# EAGLE design flow3r-pot (EAGLE 9.6.2)
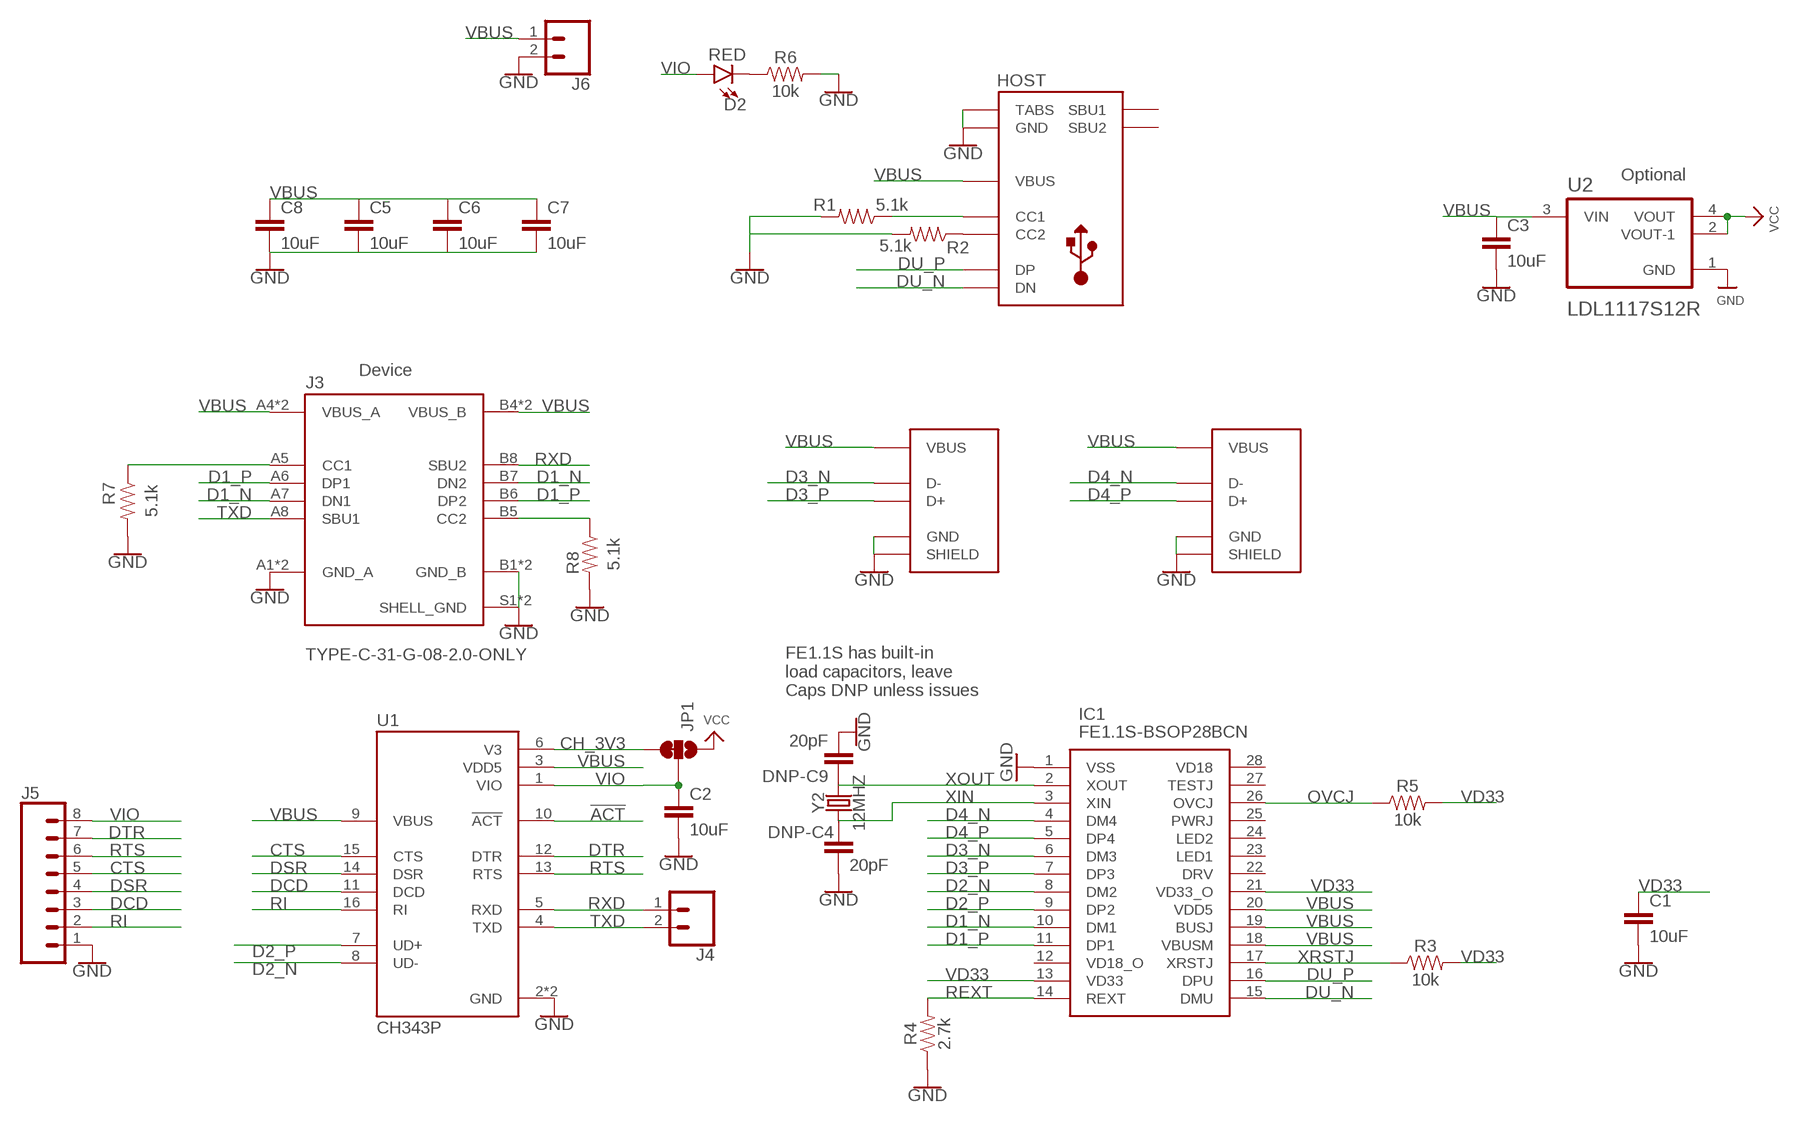
[diagram p0: schematic, sheet 1]

## Parts
C1  10uF  1.0UF-0603-16V-10%  [0603]
C2  10uF  1.0UF-0603-16V-10%  [0603]
C3  10uF  1.0UF-0603-16V-10%  [0603]
C5  10uF  1.0UF-0603-16V-10%  [0603]
C6  10uF  1.0UF-0603-16V-10%  [0603]
C7  10uF  1.0UF-0603-16V-10%  [0603]
C8  10uF  1.0UF-0603-16V-10%  [0603]
D2  RED  LED-RED0603  [LED-0603]
DNP-C4  20pF  20PF-0402T-50V-5%  [0402-TIGHT]
DNP-C9  20pF  20PF-0402T-50V-5%  [0402-TIGHT]
IC1  FE1.1S-BSOP28BCN  [SOP64P600X175-28N]
J1  JE-USB-A-C42595  [JE-USB-A-C42595]
J2  JE-USB-A-C42595  [JE-USB-A-C42595]
J3  TYPE-C-31-G-08-2.0-ONLY  [TYPE-C-31-G-08-2.0-ONLY]
J4  CONN_02  [1X02]
J5  CONN_08LOCK_LONGPADS  [1X08_LOCK_LONGPADS]
J6  CONN_02  [1X02]
JP1  JUMPER-SMT_3_1-NC_TRACE_NO-SILK  [SMT-JUMPER_3_1-NC_TRACE_NO-SILK]
R1  5.1k  5.1KOHM5.1KOHM-0603-1/10W-1%  [0603]
R2  5.1k  5.1KOHM5.1KOHM-0603-1/10W-1%  [0603]
R3  10k  10KOHM-0603-1/10W-1%  [0603]
R4  2.7k  2.7KOHM-0603-1/10W-1%  [0603]
R5  10k  10KOHM-0603-1/10W-1%  [0603]
R6  10k  10KOHM-0603-1/10W-1%  [0603]
R7  5.1k  5.1KOHM5.1KOHM-0603-1/10W-1%  [0603]
R8  5.1k  5.1KOHM5.1KOHM-0603-1/10W-1%  [0603]
U1  CH343P  [QFN50P300X300X80-17N]
U2  LDL1117S12R  [SOT230P700X180-4N]
USB-C-HOST  C709357  TYPE-C-31-M-12  [USB-TYPE-C_16PIN-MALE-TYPE-C-31-M-12]
Y2  12MHZ  CRYSTAL-12MHZ  [CRYSTAL-SMD-2X2.5MM]

## Nets
!ACT: U1.10(!ACT)
CH_3V3: JP1.3 U1.6(V3)
CTS: J5.5 U1.15(CTS)
D1_N: IC1.10(DM1) J3.A7(DN1) J3.B7(DN2)
D1_P: IC1.11(DP1) J3.A6(DP1) J3.B6(DP2)
D2_N: IC1.8(DM2) U1.8(UD-)
D2_P: IC1.9(DP2) U1.7(UD+)
D3_N: IC1.6(DM3) J1.D-
D3_P: IC1.7(DP3) J1.D+
D4_N: IC1.4(DM4) J2.D-
D4_P: IC1.5(DP4) J2.D+
DCD: J5.3 U1.11(DCD)
DSR: J5.4 U1.14(DSR)
DTR: J5.7 U1.12(DTR)
DU_N: IC1.15(DMU) USB-C-HOST.A7(DN) USB-C-HOST.B7(DN)
DU_P: IC1.16(DPU) USB-C-HOST.A6(DP) USB-C-HOST.B6(DP)
GND: C1.2 C2.2 C3.2 C5.2 C6.2 C7.2 C8.2 DNP-C4.2 DNP-C9.2 IC1.1(VSS) J1.GND J1.SHIELD-1(SHIELD) J1.SHIELD-2(SHIELD) J2.GND J2.SHIELD-1(SHIELD) J2.SHIELD-2(SHIELD) J3.A1(GND_A) J3.A12(GND_A) J3.B1(GND_B) J3.B12(GND_B) J3.S1(SHELL_GND) J3.S2(SHELL_GND) J5.1 J6.2 R1.2 R2.2 R4.1 R6.2 R7.2 R8.2 U1.2(GND) U1.17(GND) U2.1(GND) USB-C-HOST.0(TABS) USB-C-HOST.0-1(TABS) USB-C-HOST.0-2(TABS) USB-C-HOST.0-3(TABS) USB-C-HOST.A1(GND) USB-C-HOST.A12(GND) USB-C-HOST.B1(GND) USB-C-HOST.B12(GND)
N$1: R2.1 USB-C-HOST.B5(CC2)
N$2: R1.1 USB-C-HOST.A5(CC1)
N$3: D2.C R6.1
N$4: J3.B5(CC2) R8.1
N$5: J3.A5(CC1) R7.1
OVCJ: IC1.26(OVCJ) R5.1
REXT: IC1.14(REXT) R4.2
RI: J5.2 U1.16(RI)
RTS: J5.6 U1.13(RTS)
RXD: J3.B8(SBU2) J4.1 U1.5(RXD)
TXD: J3.A8(SBU1) J4.2 U1.4(TXD)
VBUS: C3.1 C5.1 C6.1 C7.1 C8.1 IC1.18(VBUSM) IC1.19(BUSJ) IC1.20(VDD5) J1.VBUS J2.VBUS J3.A4(VBUS_A) J3.A9(VBUS_A) J3.B4(VBUS_B) J3.B9(VBUS_B) J6.1 U1.3(VDD5) U1.9(VBUS) U2.3(VIN) USB-C-HOST.A4(VBUS) USB-C-HOST.A9(VBUS) USB-C-HOST.B4(VBUS) USB-C-HOST.B9(VBUS)
VCC [VCC]: JP1.1 U2.2(VOUT-1) U2.4(VOUT)
VD33: C1.1 IC1.13(VD33) IC1.21(VD33_O) R3.2 R5.2
VIO: C2.1 D2.A J5.8 JP1.2 U1.1(VIO)
XIN: DNP-C4.1 IC1.3(XIN) Y2.P1
XOUT: DNP-C9.1 IC1.2(XOUT) Y2.P3
XRSTJ: IC1.17(XRSTJ) R3.1
Unconnected: IC1.12(VD18_O) IC1.22(DRV) IC1.23(LED1) IC1.24(LED2) IC1.25(PWRJ) IC1.27(TESTJ) IC1.28(VD18) USB-C-HOST.A8(SBU1) USB-C-HOST.B8(SBU2)

## Notes on the sheet
- HOST
- Optional
- Device
- FE1.1S has built-in
  load capacitors, leave
  Caps DNP unless issues

## Library data of the parts
C1-C3 C5-C8 = SparkFun-Capacitors:1.0UF: 1µF ceramic capacitors A capacitor is a passive two-terminal electrical component used to store electrical energy temporarily in an electric field.; PROD_ID: CAP-00868; VALUE: 1.0uF
D2 = SparkFun-LED:LED-RED: Red SMD LED Used in manufacturing of most products at SparkFun Packages: 0603 - SMD 0603 package [Product Link] <http://docs.avagotech.com/docs/AV02-0551EN> 0603 SMART - SMD 0603 SMART package ( more efficient and expensive)[Product Link] <http://www.osram-os.com/Graphics/XPic2/00077099_0.pdf> 1206 - SMD1206 package [Product Link] <https://www.sparkfun.com/datasheets/DevTools/LilyPad/Q150OVS4.pdff> SparkFun Products: Pro Mini 328 -5V <https://www.sparkfun.com/products/821> RedBoard <https://www.sparkfun.com/products/12757> IOIO-OTG <https://www.sparkfun.com/products/13613>; PROD_ID: DIO-00819
DNP-C4 DNP-C9 = SparkFun-Capacitors:20PF: 20pF ceramic capacitors A capacitor is a passive two-terminal electrical component used to store electrical energy temporarily in an electric field.; PROD_ID: CAP-14843
IC1 = SamacSys_Parts:FE1.1S-BSOP28BCN: FE1.1S USB 2.0 High Speed 4-Port Hub Controller Source: Datasheet <https://datasheet.lcsc.com/lcsc/1811021220_Terminus-Tech-FE1-1S-BSOP28BCN_C9359.pdf>; DESCRIPTION: FE1.1S USB 2.0 High Speed 4-Port Hub Controller; HEIGHT: 1.75mm; MANUFACTURER_NAME: Terminus Technology; MANUFACTURER_PART_NUMBER: FE1.1S-BSOP28BCN
J1 J2 = Custom-Parts:JE-USB-A-C42595
J3 = TYPE-C-31-G-08:TYPE-C-31-G-08-2.0-ONLY; DESCRIPTION: USB-C (USB TYPE-C) USB 3.2 Gen 2 (USB 3.1 Gen 2, Superspeed + (USB 3.1)) Plug Connector 24 Position Board Edge, Cutout; Surface Mount; Through Hole, Right Angle; MF: HRO; MP: TYPE-C-31-G-08; PACKAGE: None; PRICE: None
J4 J6 = SparkFun-Connectors:CONN_02: Multi connection point. Often used as Generic Header-pin footprint for 0.1 inch spaced/style header connections On any of the 0.1 inch spaced packages, you can populate with these: Break Away Headers - Straight <https://www.sparkfun.com/products/116> (PRT-00116) Break Away Male Headers - Right Angle <https://www.sparkfun.com/products/553> (PRT-00553) Female Headers <https://www.sparkfun.com/products/115> (PRT-00115) Break Away Headers - Machine Pin <https://www.sparkfun.com/products/117> (PRT-00117) Break Away Female Headers - Swiss Machine Pin <https://www.sparkfun.com/products/743> (PRT-00743) For SCREWTERMINALS and SPRING TERMINALS visit here: Screw Terimnals on SparkFun.com <https://www.sparkfun.com/search/results?term=Screw+Terminals> (5mm/3.5mm/2.54mm spacing) This device is also useful as a general connection point to wire up your design to another part of your project. Our various solder wires solder well into these plated through hole pads. Hook-Up Wire - Assortment (Stranded, 22 AWG) <https://www.sparkfun.com/products/11375> (PRT-11375) Hook-Up Wire - Assortment (Solid Core, 22 AWG) <https://www.sparkfun.com/products/11367> (PRT-11367) View the entire wire category on our website here <https://www.sparkfun.com/categories/141> Special notes: Molex polarized connector foot print use with: PRT-08233 with associated crimp pins and housings. 2.54_SCREWTERM for use with PRT-10571. 3.5mm Screw Terminal footprints for PRT-08084 5mm Screw Terminal footprints for use with PRT-08432
J5 = SparkFun-Connectors:CONN_08: Multi connection point. Often used as Generic Header-pin footprint for 0.1 inch spaced/style header connections On any of the 0.1 inch spaced packages, you can populate with these: Break Away Headers - Straight <https://www.sparkfun.com/products/116> (PRT-00116) Break Away Male Headers - Right Angle <https://www.sparkfun.com/products/553> (PRT-00553) Female Headers <https://www.sparkfun.com/products/115> (PRT-00115) Break Away Headers - Machine Pin <https://www.sparkfun.com/products/117> (PRT-00117) Break Away Female Headers - Swiss Machine Pin <https://www.sparkfun.com/products/743> (PRT-00743) Arduino Stackable Header - 8 Pin <https://www.sparkfun.com/products/9279> (PRT-09279) For SCREWTERMINALS and SPRING TERMINALS visit here: Screw Terimnals on SparkFun.com <https://www.sparkfun.com/search/results?term=Screw+Terminals> (5mm/3.5mm/2.54mm spacing) This device is also useful as a general connection point to wire up your design to another part of your project. Our various solder wires solder well into these plated through hole pads. Hook-Up Wire - Assortment (Stranded, 22 AWG) <https://www.sparkfun.com/products/11375> (PRT-11375) Hook-Up Wire - Assortment (Solid Core, 22 AWG) <https://www.sparkfun.com/products/11367> (PRT-11367) View the entire wire category on our website here <https://www.sparkfun.com/categories/141> Special notes: Molex polarized connector foot print use with SKU : PRT-08231 with associated crimp pins and housings. 1MM SMD Version SKU: PRT-10208 NOTES ON THE VARIANTS LOCK and LOCK_LONGPADS... This footprint was designed to help hold the alignment of a through-hole component (i.e. 6-pin header) while soldering it into place. You may notice that each hole has been shifted either up or down by 0.005 of an inch from it's more standard position (which is a perfectly straight line). This slight alteration caused the pins (the squares in the middle) to touch the edges of the holes. Because they are alternating, it causes a "brace" to hold the component in place. 0.005 has proven to be the perfect amount of "off-center" position when using our standard breakaway headers. Although looks a little odd when you look at the bare footprint, once you have a header in there, the alteration is very hard to notice. Also,if you push a header all the way into place, it is covered up entirely on the bottom side.
JP1 = SparkFun-Jumpers:JUMPER-SMT_3_1-NC_TRACE: Normally closed trace jumper (1 of 2 connections) This jumper has a trace between two pads so it's normally closed (NC). The other connection is normally open (NO). Use a razor knife to open the connection. For best results follow the IPC guidelines for cutting traces: Cutout at least 0.063 mm (0.005 in). Remove all loose material to clean up the cut area. Seal the cut with an approved epoxy. Reapply solder to reclose the connection, or to close the NO connection.
R1 R2 R7 R8 = SparkFun-Resistors:5.1KOHM; PROD_ID: RES-12083
R3 R5 R6 = SparkFun-Resistors:10KOHM: 10kΩ resistor A resistor is a passive two-terminal electrical component that implements electrical resistance as a circuit element. Resistors act to reduce current flow, and, at the same time, act to lower voltage levels within circuits. - Wikipedia; PROD_ID: RES-00824
R4 = SparkFun-Resistors:2.7KOHM: 2.7kΩ resistor A resistor is a passive two-terminal electrical component that implements electrical resistance as a circuit element. Resistors act to reduce current flow, and, at the same time, act to lower voltage levels within circuits. - Wikipedia; PROD_ID: RES-16714
U1 = CH343P:CH343P: Check availability <https://pricing.snapeda.com/parts/CH343P/WCH/view-part?ref=eda>; AVAILABILITY: Not in stock; DESCRIPTION: USB to High-Speed Serial Chip CH343; MF: WCH; MP: CH343P; PACKAGE: Package; PRICE: None
U2 = LDL1117S12R:LDL1117S12R: None; AVAILABILITY: Good; DESCRIPTION: 1.2 A High PSRR low dropout linear voltage regulator; MF: STMicroelectronics; MP: LDL1117S12R; PACKAGE: SOT-223 STMicroelectronics; PRICE: 0.22 USD
USB-C-HOST = Custom-Parts:TYPE-C-31-M-12
Y2 = SparkFun-Clocks:CRYSTAL-12MHZ: 12.0MHz Crystal Frequency: 12.0MHz Frequency Tolerance: ±20ppm Load Capacitance: 18pF SparkFun Products: SparkFun Logomatic <https://www.sparkfun.com/products/12772> Pocket AVR Programmer <https://www.sparkfun.com/products/9825>; PROD_ID: XTAL-15540

## Board
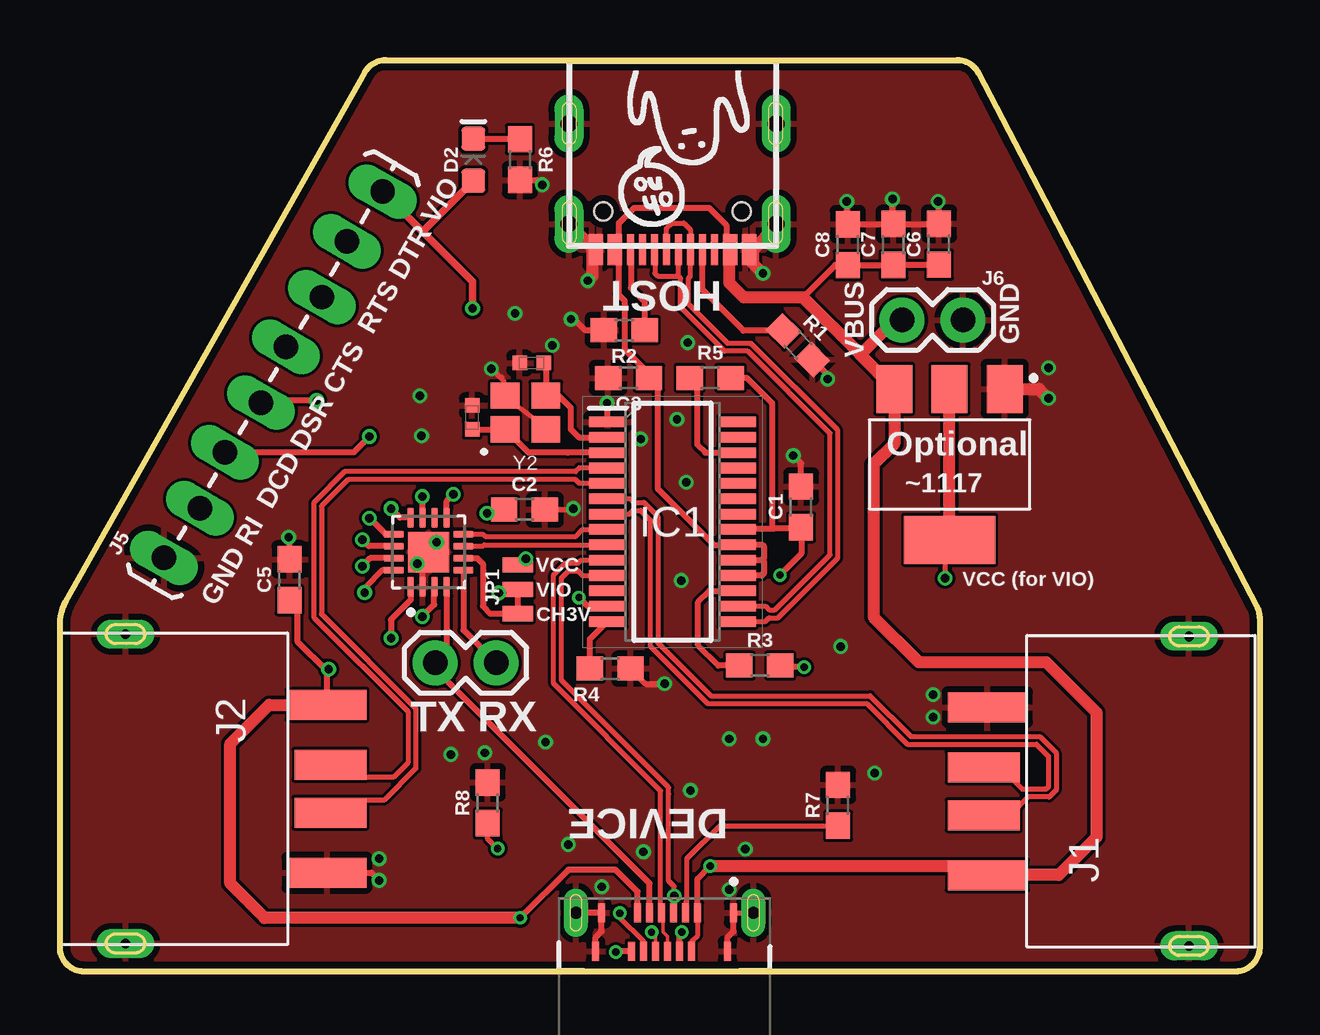
[diagram p1: board, top side]
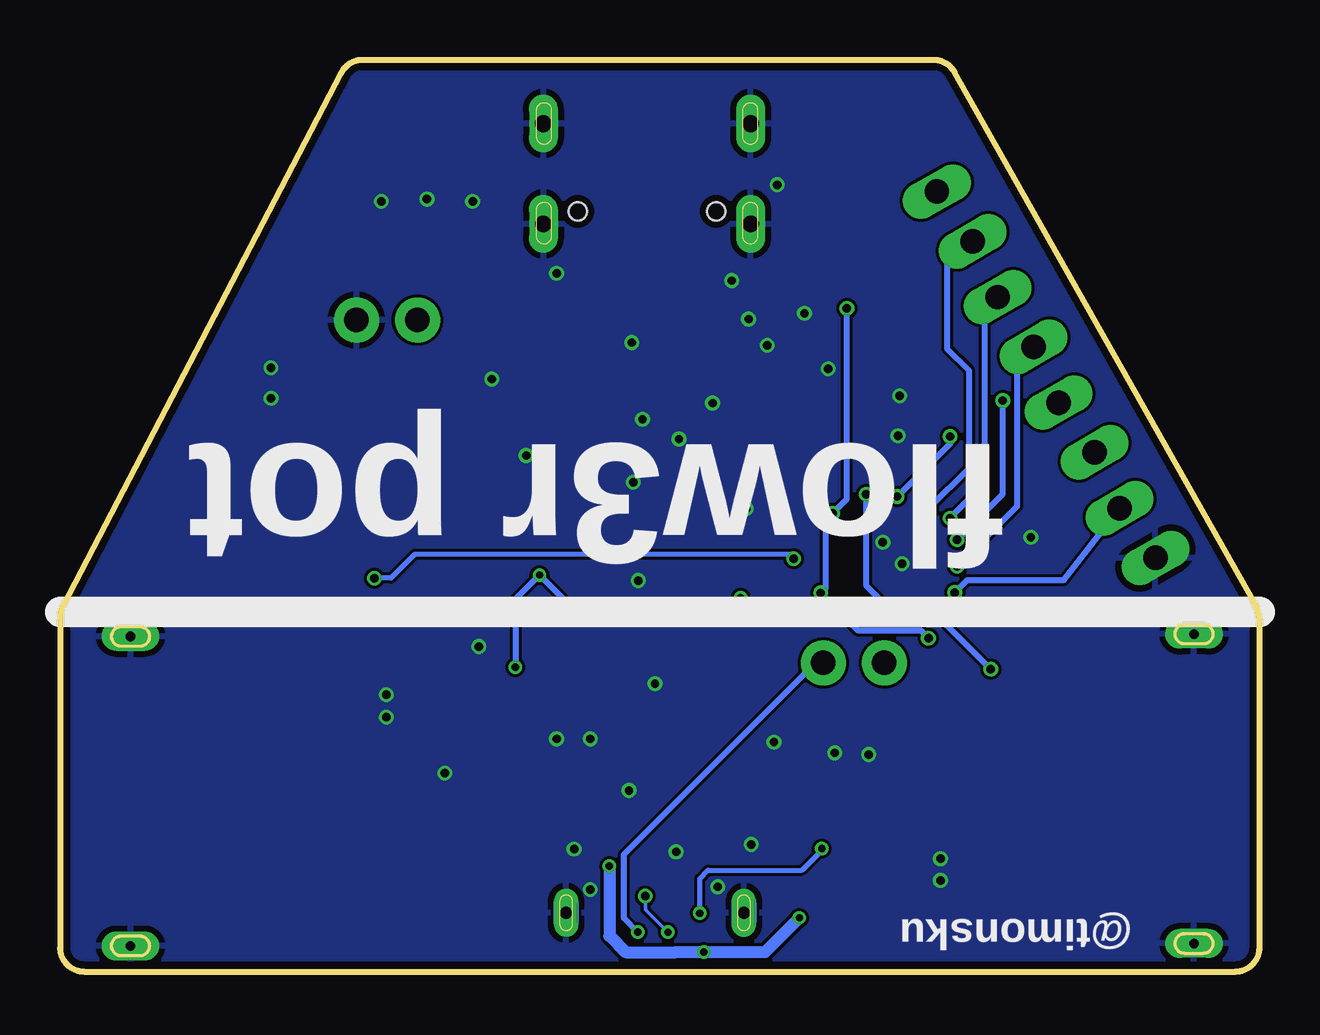
[diagram p2: board, bottom side, seen from below]

Size 50 x 38 mm. Coordinates in mm from the lower left corner, seen from the top.
Outline: 0.25,15.44 12.71,37.49 arc-61 13.58,38 37.39,38 arc-62 38.28,37.46 49.89,15.22 arc-28 50,14.76 50,1 arc-90 49,0 1,0 arc-90 0,1 0,14.5 arc-29 0.25,15.44
Copper layers (1*16): Top 0.035mm / dielectric 0.8mm / Bottom 0.035mm
Design rules "jlc-2layer *": minimum track width 5mil, minimum drill 0.3mm, track to track 5mil, track to pad 5mil, pad to pad 5mil, via to via 5mil, smd to smd 0mil, copper to edge 0.3mm, drill to drill 0.5mm, minimum pad ring 10mil, minimum via ring 0.13mm, stop-mask expansion 2mil, vias tented up to drill 100mil, thermal gap 10mil

### Footprints (pad centres in the part's own frame; a part is rotated, then mirrored left to right if it is on the bottom)
0603 = smd 1.1 x 1: 1 -0.85,0; 2 0.85,0
LED-0603 = smd 1 x 1: A -0.877,0; C 0.877,0
0402-TIGHT = smd 0.6 x 0.6: 1 -0.5,0; 2 0.5,0
SOP64P600X175-28N = smd 1.525 x 0.44: 1 -2.712,4.16; 2 -2.712,3.52; 3 -2.712,2.88; 4 -2.712,2.24; 5 -2.712,1.6; 6 -2.712,0.96; 7 -2.712,0.32; 8 -2.712,-0.32; 9 -2.712,-0.96; 10 -2.712,-1.6; 11 -2.712,-2.24; 12 -2.712,-2.88; 13 -2.712,-3.52; 14 -2.712,-4.16; 15 2.712,-4.16; 16 2.712,-3.52; 17 2.712,-2.88; 18 2.712,-2.24; 19 2.712,-1.6; 20 2.712,-0.96; 21 2.712,-0.32; 22 2.712,0.32; 23 2.712,0.96; 24 2.712,1.6; 25 2.712,2.24; 26 2.712,2.88; 27 2.712,3.52; 28 2.712,4.16
JE-USB-A-C42595 = smd 1.25 x 3: D+ 1,4.8; D- -1,4.8 | smd 1.25 x 3.3: GND 3.5,4.65; VBUS -3.5,4.65 | drill 0.4 pad 1.2 long: SHIELD-1 -6.45,-3.75; SHIELD-2 6.45,-3.75
TYPE-C-31-G-08-2.0-ONLY = smd 0.3 x 0.8: A1 2.875,0.85; A4 1.375,0.85; A5 0.875,0.85; A6 0.375,0.85; A7 -0.125,0.85; A8 -0.625,0.85; A9 -1.125,0.85; A12 -2.625,0.85; B1 -2.875,-0.75; B4 -1.375,-0.75; B5 -0.875,-0.75; B6 -0.375,-0.75; B7 0.125,-0.75; B8 0.625,-0.75; B9 1.125,-0.75; B12 2.625,-0.75 | drill 0.5 pad 0.8 long: S1 -3.7,0.85; S2 3.7,0.85
1X02 = drill 1.016 pad 1.88: 1 0,0; 2 2.54,0
1X08_LOCK_LONGPADS = drill 1.016 long: 1 0,0.127; 2 2.54,-0.127; 3 5.08,0.127; 4 7.62,-0.127; 5 10.16,0.127; 6 12.7,-0.127; 7 15.24,0.127; 8 17.78,-0.127
SMT-JUMPER_3_1-NC_TRACE_NO-SILK = smd 0.635 x 1.27: 1 -1.016,0; 2 0,0; 3 1.016,0
QFN50P300X300X80-17N = smd 0.84 x 0.28: 1 -1.445,0.75; 2 -1.445,0.25; 3 -1.445,-0.25; 4 -1.445,-0.75; 9 1.445,-0.75; 10 1.445,-0.25; 11 1.445,0.25; 12 1.445,0.75 | smd 0.28 x 0.84: 5 -0.75,-1.445; 6 -0.25,-1.445; 7 0.25,-1.445; 8 0.75,-1.445; 13 0.75,1.445; 14 0.25,1.445; 15 -0.25,1.445; 16 -0.75,1.445 | smd 1.7 x 1.7: 17 0,0
SOT230P700X180-4N = smd 1.5 x 2: 1 -2.3,-3.15; 2 0,-3.15; 3 2.3,-3.15 | smd 3.8 x 2: 4 0,3.15
USB-TYPE-C_16PIN-MALE-TYPE-C-31-M-12 = drill 0.7 pad 1.2 long: 0 -4.32,1.556; 0-1 4.32,1.556; 0-2 4.32,-2.624; 0-3 -4.32,-2.624 | smd 0.3 x 1.3: A1 -3.35,2.623; A4 -2.55,2.623; A5 -1.25,2.623; A6 -0.25,2.623; A7 0.25,2.623; A8 1.25,2.624; A9 2.55,2.623; A12 3.35,2.623; B1 3.05,2.623; B4 2.25,2.623; B5 1.75,2.623; B6 0.75,2.623; B7 -0.75,2.623; B8 -1.75,2.624; B9 -2.25,2.623; B12 -3.05,2.623 | hole 0.75: 2.89,1.026; -2.89,1.026
CRYSTAL-SMD-2X2.5MM = smd 1.2 x 1.1: P1 0.846,0.69; P2 -0.854,0.69; P3 -0.854,-0.71; P4 0.846,-0.71

### Placement (x,y rotation side)
C1  30.89,19.37 90 top
C2  19.36,19.26 0 top
C3  23.7,24.75 180 top
C5  9.57,16.33 90 top
C6  36.64,30.32 90 top
C7  34.74,30.31 90 top
C8  32.84,30.3 90 top
D2  17.23,33.84 90 top
DNP-C4  17.18,23.1 90 top
DNP-C9  19.66,25.37 180 top
IC1  25.53,18.75 0 top
J1  43.31,7.52 90 top
J2  6.48,7.62 270 top
J3  25.2,1.6 0 top
J4  18.18,12.87 180 top
J5  4.45,17.18 60 top
J6  35.1,27.16 0 top
JP1  19.08,15.93 270 top
R1  30.76,26.11 315 top
R2  23.52,26.74 180 top
R3  29.17,12.76 0 top
R4  22.93,12.63 180 top
R5  27.1,24.74 0 top
R6  19.17,33.85 270 top
R7  32.43,6.93 90 top
R8  17.83,7.03 90 top
U1  15.37,17.48 90 top
U2  37.08,21.14 180 top
U$2  [OHNO-6.5]  28.75,37.54 180 top
USB-C-HOST  25.53,32.72 180 top
Y2  19.4,23.3 180 top

### Tracks (layer width: path | path; a pad name or v marks a point on that pad's centre or on a via)
CH_3V3
  Top 0.254: U1.6 17.39,17.23 17.63,16.99 17.63,15.22 17.94,14.91 JP1.3
CTS  (via drill 0.35)
  Top 0.254: U1.15 12.93,17.23 v12.6,16.9
  Bottom 0.2: 10.1,25 9.42,25.68 J5.5
  Bottom 0.254: v12.6,16.9 10.1,19.4 10.1,25
D1_N
  Top 0.152: J3.A7 25.14,2.38 25.14,1.66 25.32,1.48 J3.B7
  Top 0.2: IC1.10 21.72,17.15 21.6,17.03 21.07,17.03 20.57,16.54 20.57,12.01 25.04,7.54 25.04,2.49 J3.A7
D1_P  (via drill 0.3, 0.35)
  Top 0.152: J3.B6 24.82,1.48 v24.66,1.64
  Top 0.2: IC1.11 21.79,16.51 21.6,16.7 21.2,16.7 20.9,16.4 20.9,12.14 25.37,7.67 25.37,7.39 25.37,3.79 25.6,3.55 v25.6,3.14 v25.59,3.13 25.59,2.47 J3.A6
  Bottom 0.152: v24.66,1.64 25.6,2.58 v25.6,3.14
D2_N
  Top 0.2: U1.8 17.64,18.23 17.72,18.14 21.5,18.14 21.79,18.43 IC1.8
D2_P
  Top 0.2: U1.7 17.64,17.73 17.7,17.79 IC1.9
D3_N
  Top 0.2: IC1.6 23.75,19.71 23.91,19.55 24.34,19.55 24.93,18.96 24.93,13.7 27.13,11.5 33.76,11.5 35.46,9.8 40.84,9.8 41.53,9.11 41.53,7.57 41.23,7.27 40.34,7.27 39.59,6.52 J1.D-
D3_P
  Top 0.2: IC1.7 23.73,19.07 23.89,19.23 24.2,19.23 24.6,18.83 24.6,13.56 26.99,11.17 33.63,11.17 35.33,9.47 40.7,9.47 41.2,8.97 41.2,7.7 41.1,7.6 40.1,7.6 39.19,8.52 J1.D+
D4_N
  Top 0.2: IC1.4 21.66,20.99 21.5,20.83 11.87,20.83 10.57,19.54 10.57,14.77 14.5,10.84 14.5,8.7 13.9,8.1 11.8,8.1 J2.D-
D4_P
  Top 0.2: IC1.5 21.66,20.35 21.5,20.51 12.01,20.51 11.35,19.85 10.9,19.4 10.9,14.9 14.83,10.97 14.83,8.46 13.5,7.14 11.8,7.14 J2.D+
DCD  (via drill 0.35)
  Top 0.254: U1.11 15.12,19.78 v15.1,19.8 | v12.9,22.3 12.24,21.64 J5.3
  Bottom 0.254: v15.1,19.8 12.9,22 v12.9,22.3
DSR  (via drill 0.35)
  Top 0.254: U1.14 12.87,17.73 v12.6,18 | J5.4 8.45,23.8 v10.7,23.8
  Bottom 0.254: v12.6,18 10.7,19.9 v10.7,23.8
DTR  (via drill 0.35)
  Top 0.254: U1.12 14.18,18.93 v13.8,19.3
  Bottom 0.254: v13.8,19.3 12.1,21 12.1,25.04 13.03,25.97 13.03,29.71 12.3,30.44 J5.7
DU_N
  Top 0.2: IC1.15 29.4,14.59 29.56,14.75 29.93,14.75 32.43,17.24 32.43,22.57 28.8,26.19 27.84,26.19 26.2,27.83 26.2,28.9 26.28,28.98 USB-C-HOST.B7 26.28,30.92 26,31.2 25.5,31.2 25.28,30.98 USB-C-HOST.A7
DU_P
  Top 0.2: IC1.16 29.4,15.23 29.56,15.07 29.8,15.07 32.1,17.37 32.1,22.43 28.67,25.86 27.7,25.86 25.87,27.69 25.87,28.9 25.78,28.99 | 25.78,28.99 USB-C-HOST.A6 | USB-C-HOST.B6 24.8,30.08 24.8,29.1 24.91,28.99 25.78,28.99
GND  (via drill 0.35)
  Top 0.2: C2.2 21.4,19.26 v21.4,19.3 | J3.A1 J3.S2 | 18.41,24.79 18.32,24.79 v17.98,25.13 18.49,24.62 18.49,24.01 20.36,22.59
  Top 0.254: C1.2 30.89,21.19 v30.57,21.51 | v22.8,23.7 22.82,23.68 IC1.1 22.62,22.91 | R4.1 24.41,12 v25.2,12 | C6.2 | C7.2 C6.2 | C7.2 C8.2 32.8,31.19 v32.8,32.1 | C7.2 34.7,31.2 v34.7,32.2 | C6.2 36.64,32.06 v36.6,32.1 | C5.2 9.57,18.06 v9.53,18.1 | v14.9,17.01 U1.17 15.7,17.81 v15.7,17.9 | v14.9,17.01 v14.9,17 | U1.2 15.12,16.79 v14.9,17.01 | R2.2 21.89,26.74 21.43,27.2 v21.3,27.2 | R6.2 19.9,33 v20.1,32.8 | R1.2 32,24.87 v32,24.7 | J2.GND 12.98,4.12 v13.3,3.8 | J3.B1 22.32,1.43 22.57,1.68 J3.A12 J3.S1 | J3.B12 27.82,1.43 28.07,1.68 J3.A1
  Top 0.508: U2.1 40.81,24.29 v41.2,23.9 | USB-C-HOST.0 29.85,31.07 USB-C-HOST.A1 28.88,29.52 v29.3,29.1 | USB-C-HOST.0-1 22.18,30.19 USB-C-HOST.A12 22.18,28.98 v22,28.8
  other vias: 20.52,26.1 26.16,26.22 13.3,4.7 36.4,10.6 36.4,11.54 26.1,20.4 25.9,16.3 25.72,23.02 18.97,27.44 15,24 15.07,22.33 20.24,9.56 27.9,9.7 29.3,9.7 24.2,22.2 22.58,3.53 27.9,3.42 16.29,9.05 28.57,5.11 24.32,4.99 26.28,7.55 21.19,5.3 32.54,13.55 41.21,25.16 33.96,8.26 17.71,9.12
  pour Top: -4,40.5 56.5,40.5 56.5,-3 -4,-3
  pour Bottom: -6.5,42.5 59.5,42.5 59.5,-6 -6.5,-6
N$1
  Top 0.254: USB-C-HOST.B5 23.8,30.08 23.8,28.5 24.37,27.93 R2.1
N$2
  Top 0.254: R1.1 28.49,26.71 26.78,28.42 USB-C-HOST.A5
N$3
  Top 0.254: D2.C 19.15,34.72 R6.1
N$4  (via drill 0.3)
  Top 0.203: J3.B5 24.32,1.25 23.33,2.24 v23.33,2.43 | v18.25,5.12 17.83,5.54 R8.1
  Bottom 0.203: v23.33,2.43 23.33,3.87 22.98,4.22 19.08,4.22 18.25,5.05 v18.25,5.12
N$5
  Top 0.203: J3.A5 26.07,2.86 26.13,2.92 26.13,4.71 27.5,6.08 R7.1
OVCJ
  Top 0.254: R5.1 26.56,24.43 26.56,21.97 26.9,21.63 IC1.26
REXT
  Top 0.254: IC1.14 22.08,13.85 R4.2
RI  (via drill 0.35)
  Top 0.254: U1.16 13.46,16.73 12.7,15.97 v12.7,15.8
  Bottom 0.254: v12.7,15.8 12.18,16.32 8.16,16.32 J5.2
RTS  (via drill 0.35)
  Top 0.2: U1.13 13.57,18.23
  Top 0.254: 13.57,18.23 v12.9,18.9
  Bottom 0.254: v12.9,18.9 11.44,20.36 11.44,27.59 J5.6
RXD  (via drill 0.3)
  Top 0.254: U1.5 16.82,14.23 J4.1 | J3.B8 25.82,1.55 v25.92,1.64
  Bottom 0.254: v25.92,1.64 26.5,2.22 26.5,4.88 18.51,12.87 J4.1
TXD
  Top 0.254: U1.4 16.12,13.35 J4.2 15.64,12.61 24.57,3.67 J3.A8
VBUS  (via drill 0.3, 0.35)
  Top 0.2: 27.9,29.5 27.9,29.98 USB-C-HOST.B9 USB-C-HOST.A4 | USB-C-HOST.A9 USB-C-HOST.B4 | J3.B9 26.32,1.25 26.59,1.52 26.59,2.44 J3.A4
  Top 0.254: USB-C-HOST.B4 23.28,28.22 23.54,27.96 23.54,25.94 24.45,25.03 24.45,24.85 C3.1 24.91,24.39 24.91,20.14 27.26,17.79 IC1.20 29.28,17.79 29.36,17.71 29.36,17.25 29.27,17.16 | J2.VBUS 11.13,12.53 | 11.13,12.53 v11.2,12.6 | v15.1,14.8 15.6,15.3 15.6,16.02 U1.3 | U1.9 16.12,19.62 v16.4,19.9 | USB-C-HOST.A9 23.3,30.42 23.3,31.2 23.94,31.84 27.06,31.84 27.78,31.12 USB-C-HOST.B9 | 30.97,28.1 32.32,29.45 C8.1 C7.1 C6.1 | J3.A4 26.57,3.88 v27.1,4.4 | J3.A9 24.07,3.33 23.15,4.25 21.19,4.25 v19.18,2.24 | C5.1 9.89,15.16 9.89,13.77 11.13,12.53 | IC1.19 28.25,17.16 29.27,17.16 | 29.27,17.16 29.35,17.08 29.35,16.61 29.25,16.51 IC1.18 | J3.B4 23.21,0.85 v23.17,0.81
  Top 0.508: 33.36,25.71 U2.3 34.78,22 33.91,21.13 33.91,14.79 35.8,12.9 41.1,12.9 43.2,10.8 43.2,5.6 41.63,4.03 J1.VBUS 37.67,4.02 37.3,4.39 v27.11,4.39 v27.1,4.4 | 33.36,25.71 30.97,28.1 28.5,28.1 27.9,28.7 27.9,29.5 | v19.18,2.24 8.53,2.24 7.1,3.67 7.1,9.5 8.72,11.12 J2.VBUS | 33.36,25.71 34.81,27.16 J6.1
  Bottom 0.254: v11.2,12.6 13.4,14.8 v15.1,14.8 16.4,16.1 v16.4,19.9
  Bottom 0.508: v27.1,4.4 27.1,1.48 26.43,0.81 24.33,0.81 v23.17,0.81 20.61,0.81 v19.18,2.24
VCC  (via drill 0.35)
  Top 0.2: v19.42,17.21 19.34,17.21 JP1.1 | v36.9,16.4 36.9,17.81 U2.4
  Top 0.508: U2.4 U2.2
  Bottom 0.2: v19.42,17.21 19.61,17.4 35.2,17.4 36.2,16.4 v36.9,16.4
VD33  (via drill 0.3)
  Top 0.254: IC1.21 28.27,18.46 29.75,18.46 | 29.75,18.46 30.83,18.46 C1.1 30.9,17.42 v30.01,16.53 | v31.02,12.69 30.09,12.69 R3.2 | 29.75,18.46 29.69,18.52 29.69,18.56 29.69,23.68 28.63,24.74 R5.2 | IC1.13 21.99,15.23 v21.63,15.59
  Bottom 0.254: v31.02,12.69 v31.01,12.7 31.01,15.53 v30.01,16.53 28.7,15.22 22,15.22 v21.63,15.59
VIO  (via drill 0.35)
  Top 0.254: U1.1 14.62,15.49 13.8,14.68 v13.8,13.9 | v17.8,19.1 17.96,19.26 C2.1 | JP1.2 18.44,15.93 v18.29,15.78
  Top 0.305: J5.8 15.08,30.88 | D2.A 15.15,30.88 15.08,30.88 | v17.2,27.64 17.2,28.76 15.08,30.88
  Bottom 0.254: v13.8,13.9 14.1,14.2 16.71,14.2 v18.29,15.78 18.09,15.98 18.09,18.81 v17.8,19.1 17.2,19.7 v17.2,27.64
XIN
  Top 0.254: IC1.3 21.17,21.63 19.53,21.63 Y2.P1 DNP-C4.1
XOUT
  Top 0.254: IC1.2 21.63,22.27 21.29,22.61 21.29,23.51 20.79,24.01 Y2.P3 20.25,25.26 DNP-C9.1
XRSTJ
  Top 0.254: R3.1 27.44,12.76 26.6,13.6 26.6,15.4 27.07,15.87 IC1.17

### Text on the board
tPlace: HOST | VBUS | GND | Optional | ~1117 | VCC | VIO | VCC (for VIO) | GND RI DCD DSR CTS RTS DTR VIO | CH3V | TX RX | DEVICE
bPlace: flow3r pot | @timonsku